# EAGLE design ThermoStat2 (EAGLE 6.4)
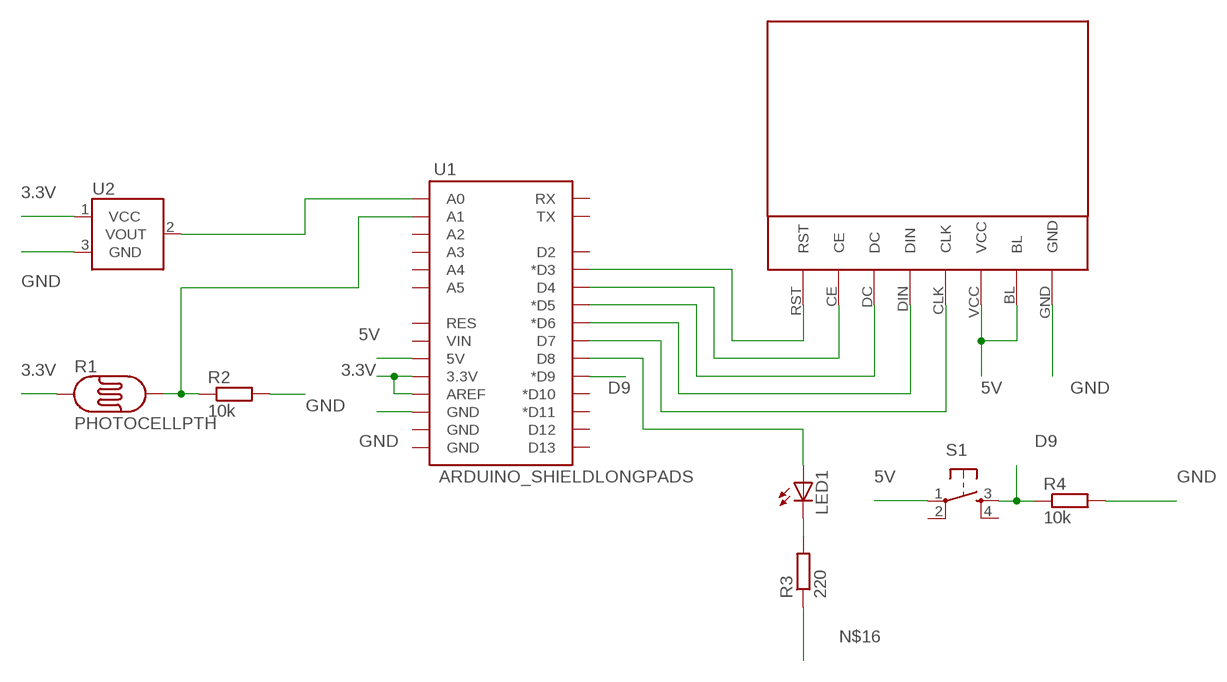
[diagram p0: schematic, sheet 1]

## Parts
LED1  LED5MM  [LED5MM]
R1  PHOTOCELLPTH  [PHOTOCELL]
R2  10k  R-EU_0207/15  [0207/15]
R3  220  R-EU_0207/15  [0207/15]
R4  10k  R-EU_0207/15  [0207/15]
S1  TAC_SWITCHPTH  [TACTILE-PTH]
U1  ARDUINO_SHIELDLONGPADS  [DUEMILANOVE_SHIELD_LONGPADS]
U2  TMP36GT9  [TO-92]
U$1  NOKIA5510  [NOKIA5510]

## Nets
3.3V: R1.1 U1.3.3V U1.AREF U2.1(VCC)
5V: S1.1 U1.5V U$1.BL U$1.VCC
D9: R4.1 S1.3 U1.D9(*D9)
GND: R2.2 R4.2 U1.GND@2(GND) U2.3(GND) U$1.GND
N$1: R1.2 R2.1 U1.A1
N$2: U1.A0 U2.2(VOUT)
N$7: U1.D3(*D3) U$1.RST
N$8: U1.D4 U$1.CE
N$9: U1.D5(*D5) U$1.DC
N$10: U1.D6(*D6) U$1.DIN
N$11: U1.D7 U$1.CLK
N$15: LED1.K(C) R3.2
N$16: R3.1
N$17: LED1.A U1.D8
Unconnected: S1.2 S1.4 U1.A2 U1.A3 U1.A4 U1.A5 U1.D2 U1.D10(*D10) U1.D11(*D11) U1.D12 U1.D13 U1.GND@0(GND) U1.GND@1(GND) U1.RES U1.RX U1.TX U1.VIN

## Library data of the parts
LED1 = SparkFun-LED:LED: LEDs Standard schematic elements and footprints for 5mm, 3mm, 1206, and 0603 sized LEDs. 5mm - Spark Fun Electronics SKU : COM-00529 (and others)
R1 = SparkFun:PHOTOCELL: Photocell Also known as a CdS photoresistor. This is a low cost way to detect light levels. Resistance decreases with more incoming light. SparkFun SKU: SEN-09088
R2-R4 = rcl:R-EU_: RESISTOR, European symbol
S1 = SparkFun:TAC_SWITCH: Momentary Switch Button commonly used for reset or general input. Spark Fun Electronics SKU : COM-00097
U1 = SparkFun-Boards:ARDUINO_SHIELD: Arduino shield footprint
U2 = SparkFun-Sensors:TMP36: Precision degC temp sensor, analog out
U$1 = atmel:NOKIA5510

## Board
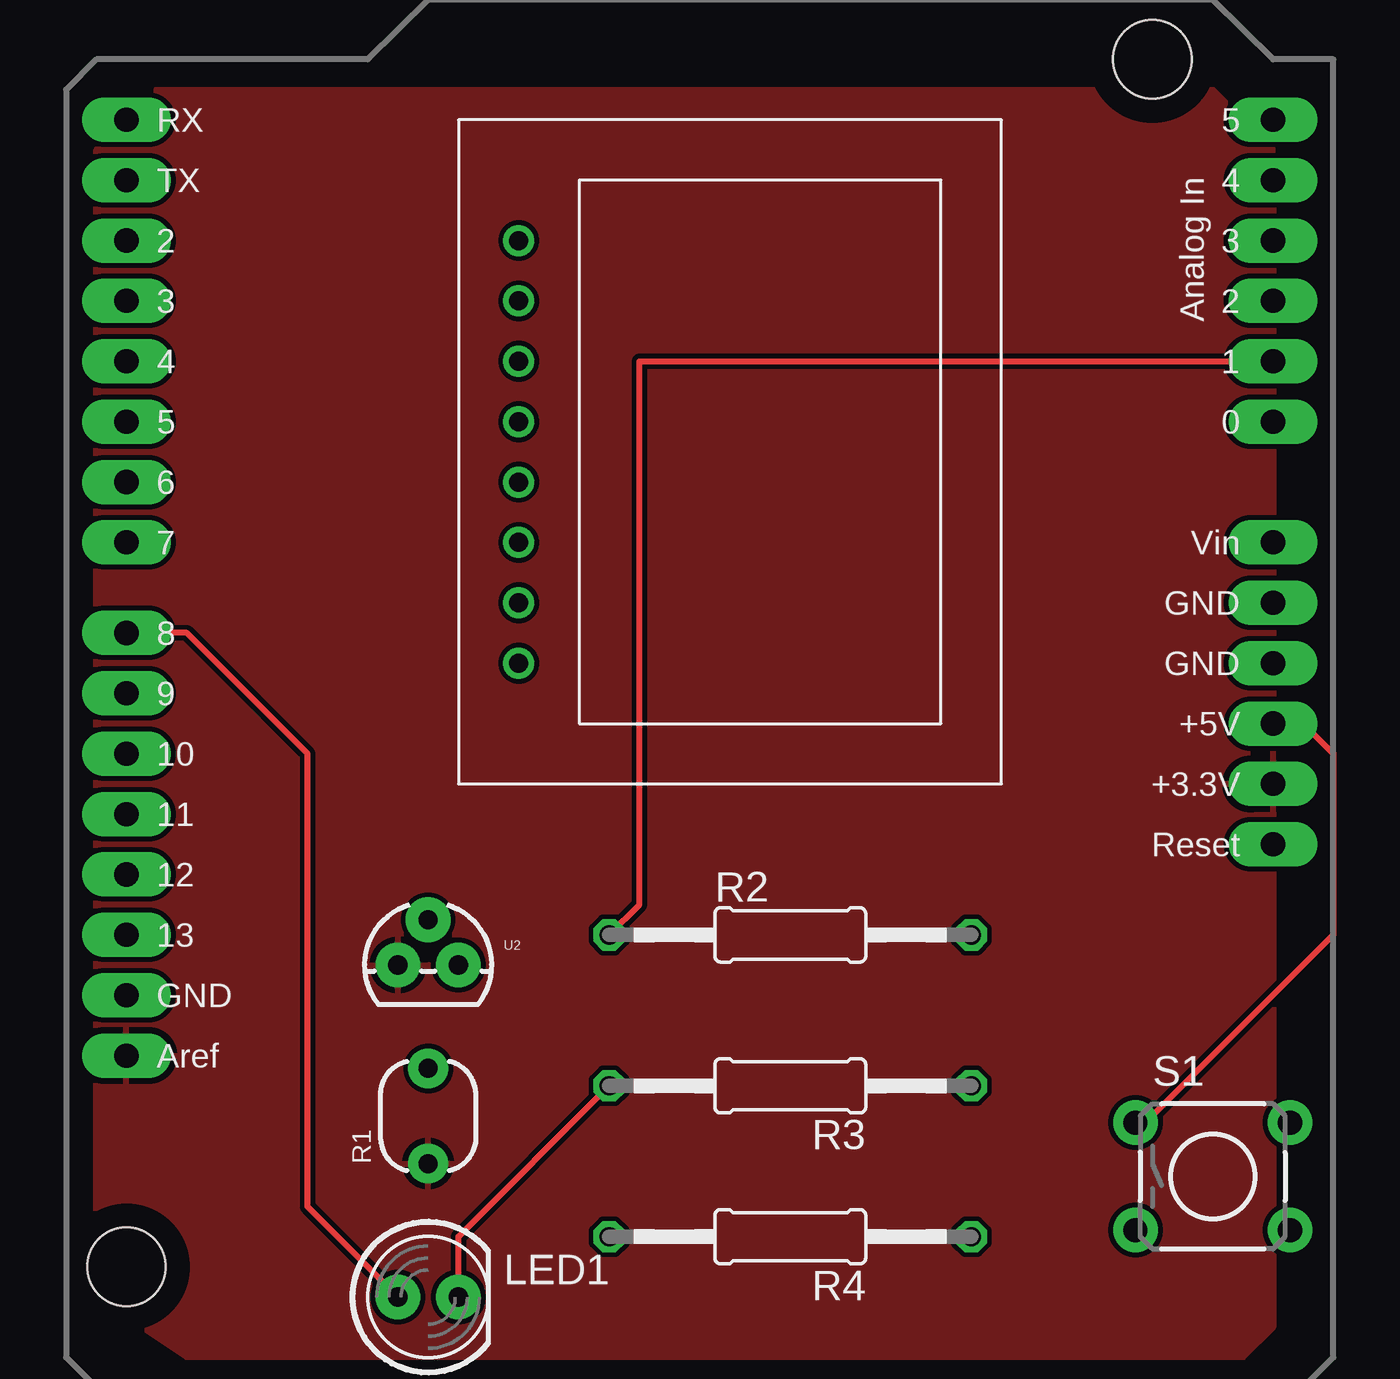
[diagram p1: board, top side]
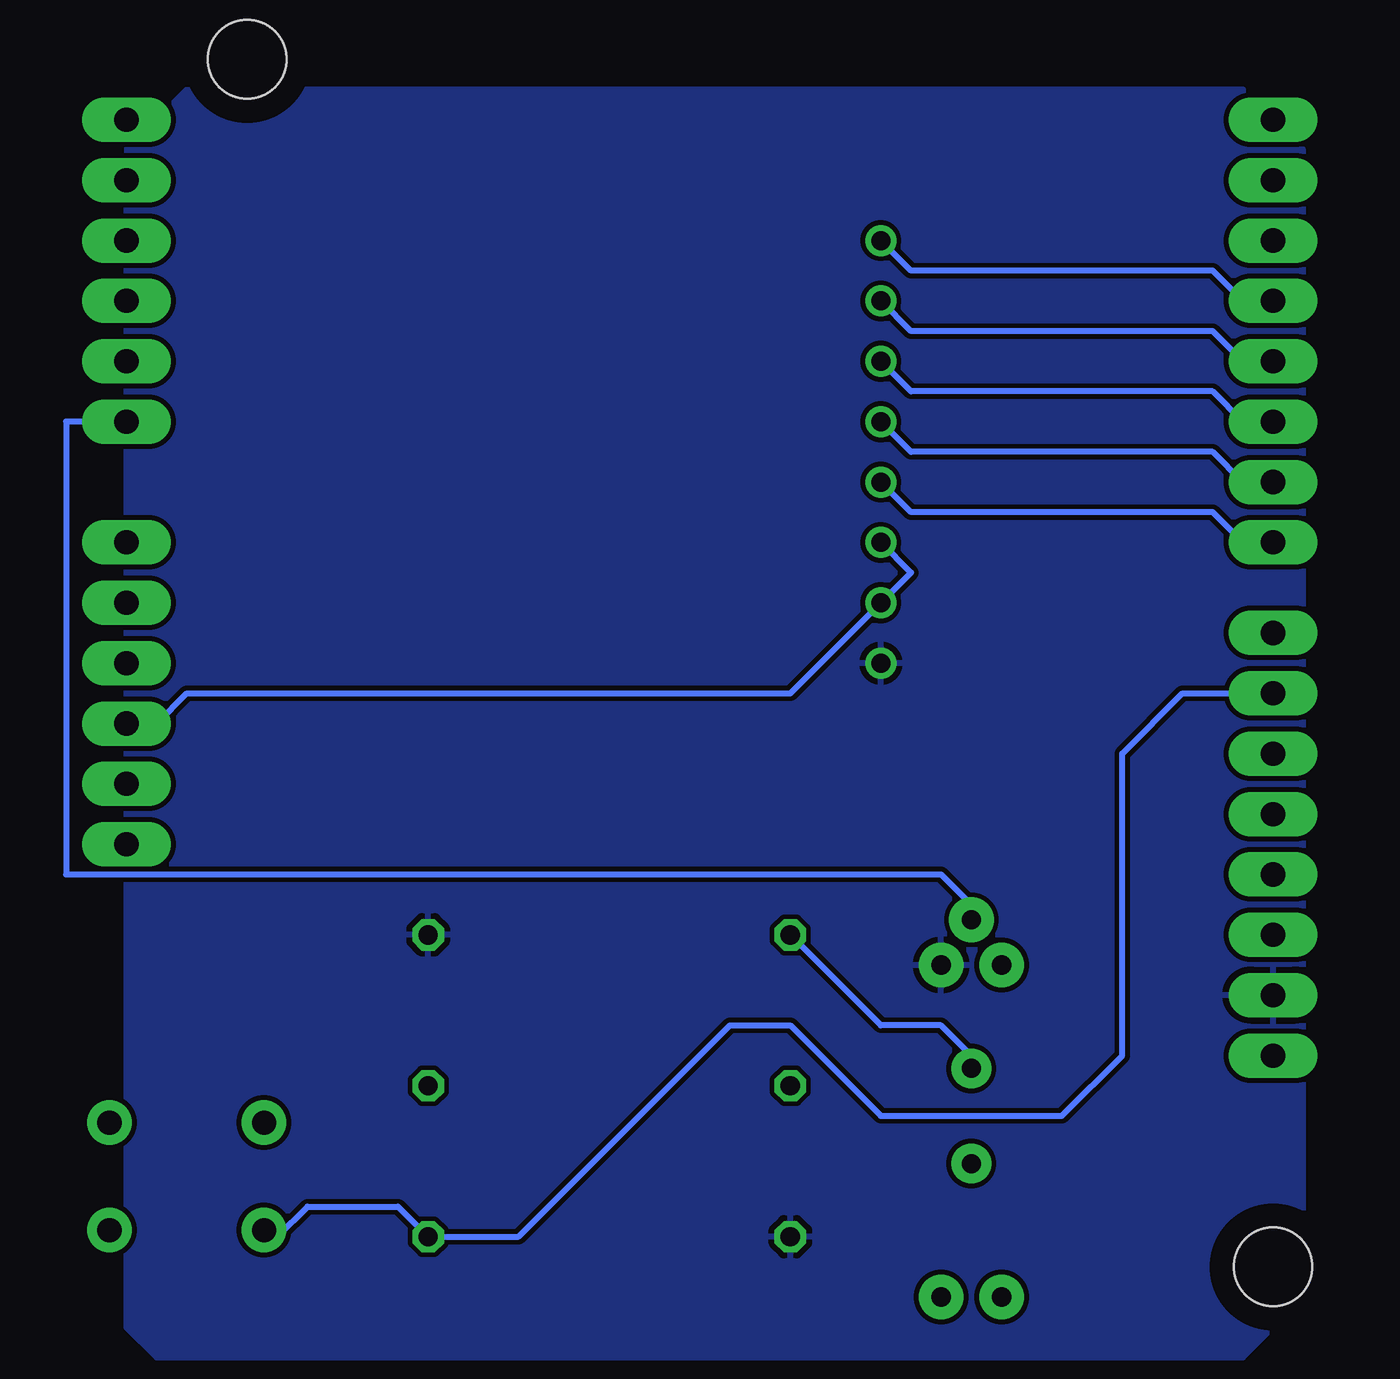
[diagram p2: board, bottom side, seen from below]

No outline drawn. Coordinates in mm, seen from the top.
Copper layers (1*16): Top 0.035mm / dielectric 1.5mm / Bottom 0.035mm
Design rules "default": minimum track width 10mil, minimum drill 24mil, track to track 8mil, track to pad 8mil, pad to pad 8mil, via to via 8mil, smd to smd 8mil, copper to edge 40mil, drill to drill 8mil, minimum pad ring 10mil, minimum via ring 8mil, stop-mask expansion 4mil, vias tented up to drill 0mil, thermal gap 10mil

### Footprints (pad centres in the part's own frame; a part is rotated, then mirrored left to right if it is on the bottom)
LED5MM = drill 0.813 pad 1.88: A -1.27,0; K 1.27,0
PHOTOCELL = drill 0.8 pad 1.676: 1 -2,0; 2 2,0
0207/15 = drill 0.813 octagon: 1 -7.62,0; 2 7.62,0
TACTILE-PTH = drill 1.016 pad 1.88: 1 -3.251,2.261; 2 3.251,2.261; 3 -3.251,-2.261; 4 3.251,-2.261
DUEMILANOVE_SHIELD_LONGPADS = drill 1.016 pad 1.88 long: 3.3V 50.8,26.67; 5V 50.8,29.21; A0 50.8,41.91; A1 50.8,44.45; A2 50.8,46.99; A3 50.8,49.53; A4 50.8,52.07; A5 50.8,54.61; AREF 2.54,15.24; D2 2.54,49.53; D3 2.54,46.99; D4 2.54,44.45; D5 2.54,41.91; D6 2.54,39.37; D7 2.54,36.83; D8 2.54,33.02; D9 2.54,30.48; D10 2.54,27.94; D11 2.54,25.4; D12 2.54,22.86; D13 2.54,20.32; GND@0 50.8,31.75; GND@1 50.8,34.29; GND@2 2.54,17.78; RES 50.8,24.13; RX 2.54,54.61; TX 2.54,52.07; VIN 50.8,36.83 | hole 3.302: 45.72,57.15; 2.54,6.35
TO-92 = drill 0.813 pad 1.88: 1 -1.27,0; 2 0,1.905; 3 1.27,0
NOKIA5510 = drill 0.8: BL 6.35,0; CE -6.35,0; CLK 1.27,0; DC -3.81,0; DIN -1.27,0; GND 8.89,0; RST -8.89,0; VCC 3.81,0

### Placement (x,y rotation side)
LED1  21.59,20.32 0 top
R1  21.59,27.94 90 top
R2  36.83,35.56 0 top
R3  36.83,29.21 180 top
R4  36.83,22.86 180 top
S1  54.61,25.4 0 top
U1  6.35,15.24 0 top
U2  21.59,34.29 0 top
U$1  25.4,55.88 270 top

### Tracks (layer width: path | path; a pad name or v marks a point on that pad's centre or on a via)
3.3V
  pour Top: 7.62,68.58 10.16,71.12 54.61,71.12 57.15,68.58 57.15,19.05 55.88,17.78 11.43,17.78 7.62,20.32
5V
  Top 0.254: U1.5V 58.42,44.45 59.69,43.18 59.69,35.56 52.07,27.94 S1.1
  Bottom 0.254: U$1.VCC 24.13,50.8 U$1.BL 29.21,45.72 54.61,45.72 55.88,44.45 U1.5V
D9
  Bottom 0.254: S1.3 50.8,22.86 49.53,24.13 45.72,24.13 R4.1 40.64,22.86 31.75,31.75 29.21,31.75 25.4,27.94 17.78,27.94 15.24,30.48 15.24,43.18 12.7,45.72 U1.D9
GND
  pour Bottom: 7.62,67.31 7.62,68.58 10.16,71.12 54.61,71.12 57.15,68.58 57.15,19.05 55.88,17.78 10.16,17.78 7.62,20.32
N$1
  Top 0.254: U1.A1 30.48,59.69 30.48,36.83 R2.1
  Bottom 0.254: R2.1 25.4,31.75 22.86,31.75 21.59,30.48 R1.2
N$2
  Bottom 0.254: U1.A0 59.69,57.15 59.69,38.1 22.86,38.1 21.59,36.83 U2.2
N$7
  Bottom 0.254: U$1.RST 24.13,63.5 11.43,63.5 10.16,62.23 U1.D3
N$8
  Bottom 0.254: U$1.CE 24.13,60.96 11.43,60.96 10.16,59.69 U1.D4
N$9
  Bottom 0.254: U$1.DC 24.13,58.42 11.43,58.42 10.16,57.15 U1.D5
N$10
  Bottom 0.254: U$1.DIN 24.13,55.88 11.43,55.88 10.16,54.61 U1.D6
N$11
  Bottom 0.254: U$1.CLK 24.13,53.34 11.43,53.34 10.16,52.07 U1.D7
N$15
  Top 0.254: R3.2 22.86,22.86 LED1.K
N$17
  Top 0.254: LED1.A 16.51,24.13 16.51,43.18 11.43,48.26 U1.D8